# Altium schematic sheet Sheet2.SchDoc: [Название]
size 420 x 297 mm; ApprovedBy: [Утвердил]; CheckedBy: [Пров.]; Author: [Разраб.]; CompanyName: [Компания]; DocumentNumber: [АБВГ.000000.000]; SheetNumber: [Лист]; SheetTotal: [Листов]; ProcessInspection: [Т. контр.]; NormInspection: [Н. контр.]; firstReference: [Перв. применение]; CopiedBy: [Копировал]
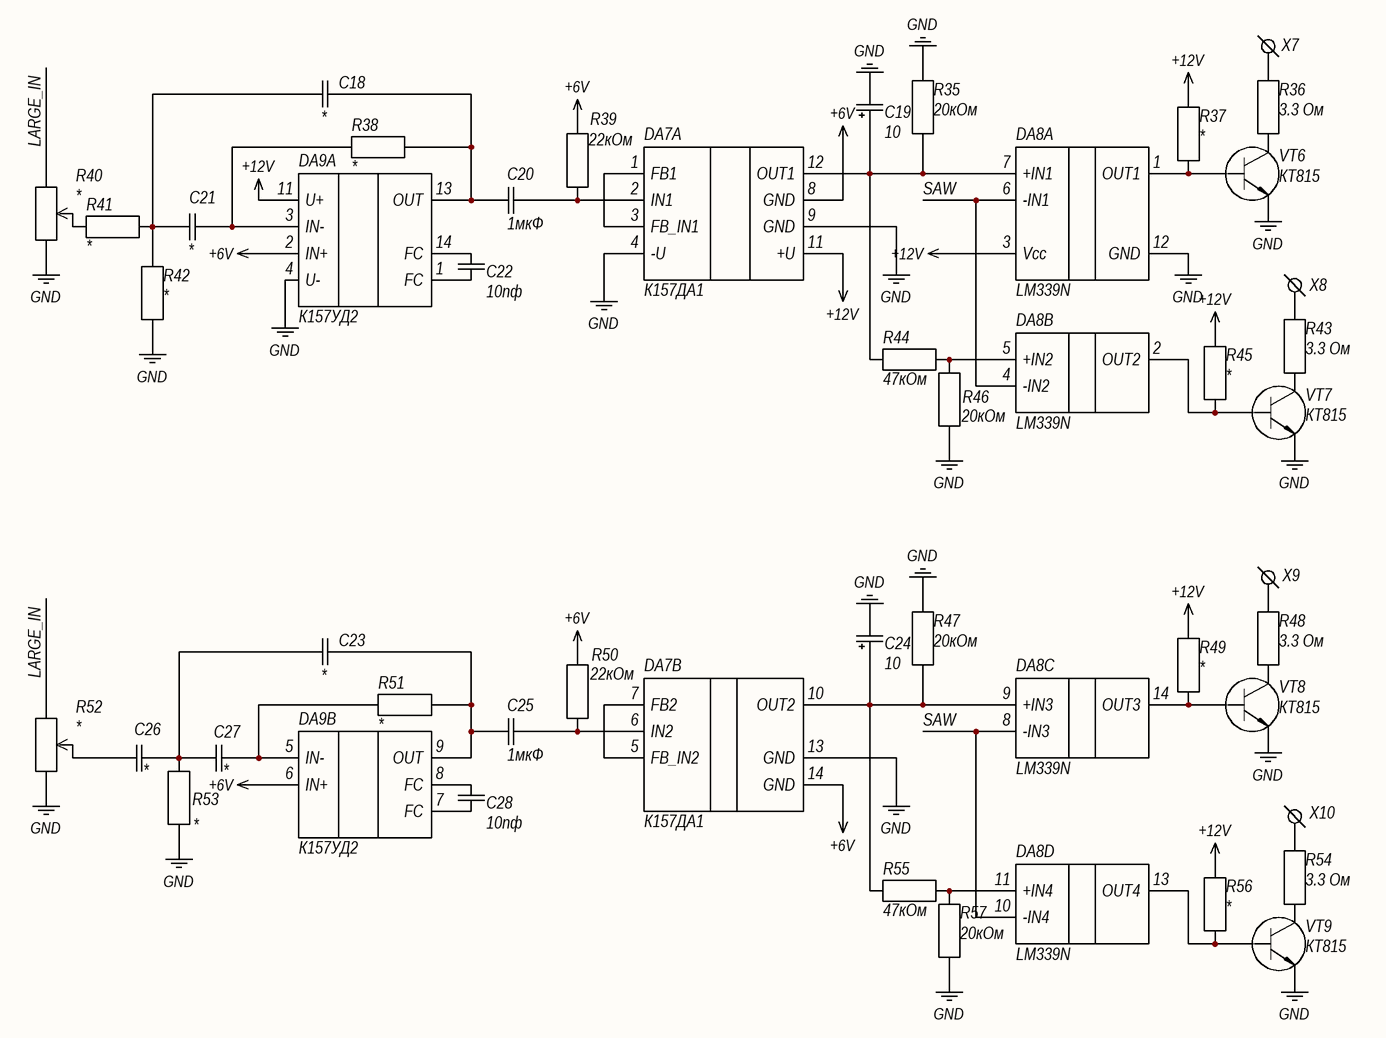
[diagram p0: Sheet2.SchDoc]

## Parts
C18  *  [C 15mm]
C19  10  [C 3.5mm]
C20  1мкФ  [C 10mm]
C21  *  [C 15mm]
C22  10пф  [C 10mm]
C23  *  [C 15mm]
C24  10  [C 3.5mm]
C25  1мкФ  [C 10mm]
C26  *  [C 15mm]
C27  *  [C 15mm]
C28  10пф  [C 10mm]
DA7  К157ДА1  [14-LEAD DIP]  (parts A,B of 2)
DA8  LM339N  [14-LEAD DIP]  (parts A,B,C,D of 4)
DA9  К157УД2  [14-LEAD DIP]  (parts A,B of 2)
R35  20кОм  [R 10mm]
R36  3.3 Ом  [R 10mm]
R37  *  [R 10mm]
R38  *  [R 10mm]
R39  22кОм  [R 10mm]
R40  *  [OFF BOARD RESISTOR]
R41  *  [R 10mm]
R42  *  [R 10mm]
R43  3.3 Ом  [R 10mm]
R44  47кОм  [R 10mm]
R45  *  [R 10mm]
R46  20кОм  [R 10mm]
R47  20кОм  [R 10mm]
R48  3.3 Ом  [R 10mm]
R49  *  [R 10mm]
R50  22кОм  [R 10mm]
R51  *  [R 10mm]
R52  *  [OFF BOARD RESISTOR]
R53  *  [R 10mm]
R54  3.3 Ом  [R 10mm]
R55  47кОм  [R 10mm]
R56  *  [R 10mm]
R57  20кОм  [R 10mm]
VT6  КТ815  [KT-27]
VT7  КТ815  [KT-27]
VT8  КТ815  [KT-27]
VT9  КТ815  [KT-27]
X7  (no value)  [TP 1,4mm]
X8  (no value)  [TP 1,4mm]
X9  (no value)  [TP 1,4mm]
X10  (no value)  [TP 1,4mm]

## Nets
+6V: DA7.8(GND) DA7.14(GND) DA9.2(IN+) DA9.6(IN+) R39.2 R50.2
+12V: DA7.11(+U) DA8.3(Vcc) DA9.11(U+) R37.2 R45.2 R49.2 R56.2
GND: C19.2 C24.2 DA7.4(-U) DA7.9(GND) DA7.13(GND) DA8.12(GND) DA9.4(U-) R35.2 R40.2 R42.1 R46.1 R47.2 R52.2 R53.1 R57.1 VT6.2 VT7.2 VT8.2 VT9.2
LARGE_IN: R40.1 R52.1
SAW: DA8.4(-IN2) DA8.6(-IN1) DA8.8(-IN3) DA8.10(-IN4)
NetC18_1: C18.1 C21.1 R41.2 R42.2
NetC18_2: C18.2 C20.1 DA9.13(OUT) R38.1
NetC19_1: C19.1 DA7.12(OUT1) DA8.7(+IN1) R35.1 R44.1
NetC20_2: C20.2 DA7.2(IN1) R39.1
NetC21_2: C21.2 DA9.3(IN-) R38.2
NetC22_1: C22.1 DA9.1(FC)
NetC22_2: C22.2 DA9.14(FC)
NetC23_1: C23.1 C26.2 C27.1 R53.2
NetC23_2: C23.2 C25.1 DA9.9(OUT) R51.1
NetC24_1: C24.1 DA7.10(OUT2) DA8.9(+IN3) R47.1 R55.1
NetC25_2: C25.2 DA7.6(IN2) R50.1
NetC26_1: C26.1 R52.3
NetC27_2: C27.2 DA9.5(IN-) R51.2
NetC28_1: C28.1 DA9.7(FC)
NetC28_2: C28.2 DA9.8(FC)
NetDA7_1: DA7.1(FB1) DA7.3(FB_IN1)
NetDA7_5: DA7.5(FB_IN2) DA7.7(FB2)
NetDA8_1: DA8.1(OUT1) R37.1 VT6.1
NetDA8_2: DA8.2(OUT2) R45.1 VT7.1
NetDA8_5: DA8.5(+IN2) R44.2 R46.2
NetDA8_11: DA8.11(+IN4) R55.2 R57.2
NetDA8_13: DA8.13(OUT4) R56.1 VT9.1
NetDA8_14: DA8.14(OUT3) R49.1 VT8.1
NetR36_1: R36.1 VT6.3
NetR36_2: R36.2 X7.1
NetR40_3: R40.3 R41.1
NetR43_1: R43.1 VT7.3
NetR43_2: R43.2 X8.1
NetR48_1: R48.1 VT8.3
NetR48_2: R48.2 X9.1
NetR54_1: R54.1 VT9.3
NetR54_2: R54.2 X10.1

## Notes on the sheet
- Подп. дата
- Инв. № дубл.
- Взам. инв. №
- Подп. и дата
- Инв. № подл.
- Лист
- Изм.
- № докум.
- Подп.
- Дата
- Копировал
- Формат
- А3

## Library data of the parts
C18 C20-C23 C25-C28 = Capacitor: Value1: *; ТУ: *; Url: *
  C18 C21 C23 C26 C27: Value: *
  C20 C25: Value: 1мкФ
  C22 C28: Value: 10пф
C19 C24 = Capacitor Pol: Value: 10; Value1: *; Manufacturer: *; ТУ: *; Url: *
R35-R39 R41-R51 R53-R57 = Resistor: Value1: *; ТУ: *; Manufacturer: *; Url: *
  R35 R46 R47 R57: Value: 20кОм
  R36 R43 R48 R54: Value: 3.3 Ом
  R37 R38 R41 R42 R45 R49 R51 R53 R56: Value: *
  R39 R50: Value: 22кОм
  R44 R55: Value: 47кОм
R40 R52 = ResistorVar: Value: *; Value1: *; ТУ: *; Url: *; Manufacturer: *
VT6-VT9 = NPN: Transistor; Value: КТ815; Value1: *; ТУ: *; Manufacturer: *; Url: *
X7-X10 = TP
DA7 = К157ДА1: value: К157ДА1
DA8 = LM339N: value: LM339N
DA9 = К157УД2: value: К157УД2